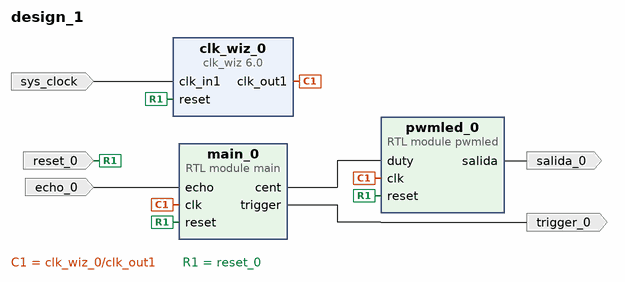
[diagram p0: block diagram of the top level]
# Vivado block design design_1, xc7z020clg400-1, Vivado 2018.3
create_bd_design design_1

create_bd_port -dir I echo_0
create_bd_port -dir O trigger_0
create_bd_port -dir O salida_0
create_bd_port -dir I -type clk sys_clock
set_property -dict {CONFIG.FREQ_HZ 125000000 CONFIG.PHASE 0.000} [get_bd_ports sys_clock]
create_bd_port -dir I -type rst reset_0
set_property -dict {CONFIG.POLARITY ACTIVE_HIGH} [get_bd_ports reset_0]

create_bd_cell -type module -reference main main_0
create_bd_cell -type module -reference pwmled pwmled_0
create_bd_cell -type ip -vlnv xilinx.com:ip:clk_wiz:6.0 clk_wiz_0
set_property -dict {CONFIG.CLK_IN1_BOARD_INTERFACE sys_clock CONFIG.USE_BOARD_FLOW true} [get_bd_cells clk_wiz_0]

# ---- connections ----

connect_bd_net [get_bd_pins main_0/cent] [get_bd_pins pwmled_0/duty]
connect_bd_net -net echo_0_1 [get_bd_ports echo_0] [get_bd_pins main_0/echo]
connect_bd_net -net clk_0_1 [get_bd_pins clk_wiz_0/clk_out1] [get_bd_pins main_0/clk] [get_bd_pins pwmled_0/clk]
connect_bd_net [get_bd_pins main_0/trigger] [get_bd_ports trigger_0]
connect_bd_net [get_bd_pins pwmled_0/salida] [get_bd_ports salida_0]
connect_bd_net [get_bd_ports sys_clock] [get_bd_pins clk_wiz_0/clk_in1]
connect_bd_net -net reset_0_1 [get_bd_ports reset_0] [get_bd_pins clk_wiz_0/reset] [get_bd_pins main_0/reset] [get_bd_pins pwmled_0/reset]

validate_bd_design
save_bd_design
